# Altium project POGO adapter.PrjPcb
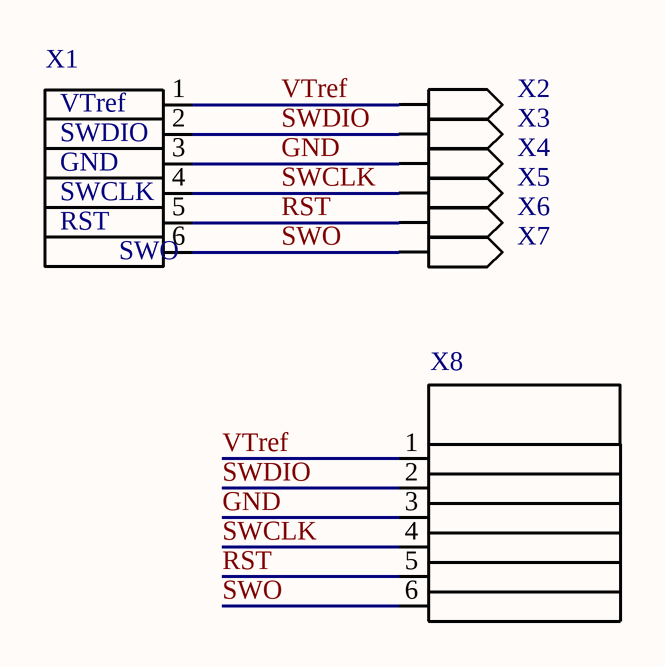
[diagram p0: POGO adapter.SchDoc]
1 sheet, 8 parts. Net scope: global (net labels, ports and power ports of the same name join across sheets).
Board file: POGO adapter.PcbDoc

## Sheet POGO adapter.SchDoc
size A4

### Parts
X1  IDC10 edge  [BH-6 edge]  (value not drawn)
X2  POGO  [POGO]  (value not drawn)
X3  POGO  [POGO]  (value not drawn)
X4  POGO  [POGO]  (value not drawn)
X5  POGO  [POGO]  (value not drawn)
X6  POGO  [POGO]  (value not drawn)
X7  POGO  [POGO]  (value not drawn)
X8  PLS-6R  [PLS-6R]  (value not drawn)

### Nets
GND: X1.3 X4.1 X8.3
RST: X1.5 X6.1 X8.5
SWCLK: X1.4 X5.1 X8.4
SWDIO: X1.2 X3.1 X8.2
SWO: X1.6 X7.1 X8.6
VTref: X1.1 X2.1 X8.1

### Notes on the sheet
- (near X1) VTref
- (near X1) SWDIO
- (near X1) GND
- (near X1) SWCLK
- (near X1) RST
- (near X1) SWO

### Library data of the parts
X8 = PLS-6R: 2.00 mm Single-Row Connector THM